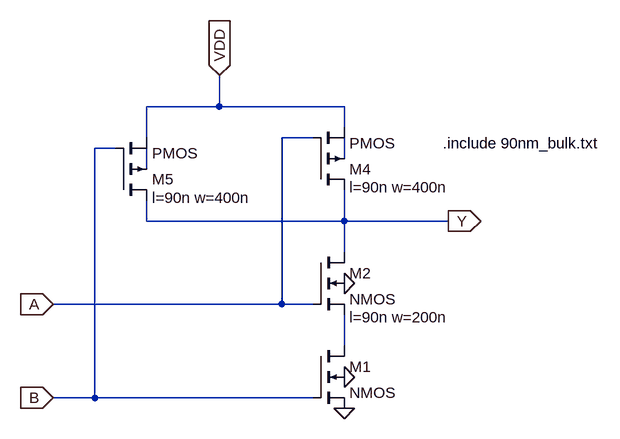
[diagram p0: schematic nand2.asc]
nand2.asc, the LTspice schematic file:
Version 4.1
SHEET 1 1496 680
WIRE 688 -48 688 -96
WIRE 688 -48 576 -48
WIRE 880 -48 688 -48
WIRE 880 -16 880 -48
WIRE 576 0 576 -48
WIRE 832 0 784 0
WIRE 528 16 496 16
WIRE 880 32 880 0
WIRE 576 48 576 16
WIRE 576 128 576 96
WIRE 880 128 880 80
WIRE 880 128 576 128
WIRE 1040 128 880 128
WIRE 880 176 880 128
WIRE 784 256 784 0
WIRE 784 256 432 256
WIRE 832 256 784 256
WIRE 880 320 880 272
WIRE 496 400 496 16
WIRE 496 400 432 400
WIRE 832 400 496 400
FLAG 880 416 0
FLAG 1040 128 Y
IOPIN 1040 128 Out
FLAG 432 256 A
IOPIN 432 256 In
FLAG 432 400 B
IOPIN 432 400 In
FLAG 688 -96 VDD
IOPIN 688 -96 In
FLAG 880 224 0
FLAG 880 368 0
SYMBOL nmos4 832 320 R0
SYMATTR InstName M1
SYMATTR Value2 l=90n w=200n
SYMBOL nmos4 832 176 R0
WINDOW 123 56 100 Left 2
SYMATTR Value2 l=90n w=200n
SYMATTR InstName M2
SYMBOL pmos4 528 96 M180
WINDOW 123 56 4 Left 2
SYMATTR Value2 l=90n w=400n
SYMATTR InstName M5
SYMBOL pmos4 832 80 M180
WINDOW 123 56 4 Left 2
SYMATTR Value2 l=90n w=400n
SYMATTR InstName M4
TEXT 1032 8 Left 2 !.include 90nm_bulk.txt

The netlist it stands for:
* nand2.asc
M1 N003 B 0 0 NMOS l=90n w=200n
M2 Y A N003 0 NMOS l=90n w=200n
M5 Y B VDD N002 PMOS l=90n w=400n
M4 Y A VDD N001 PMOS l=90n w=400n
.model NMOS NMOS
.model PMOS PMOS
.lib standard.mos
.include 90nm_bulk.txt
.backanno
.end